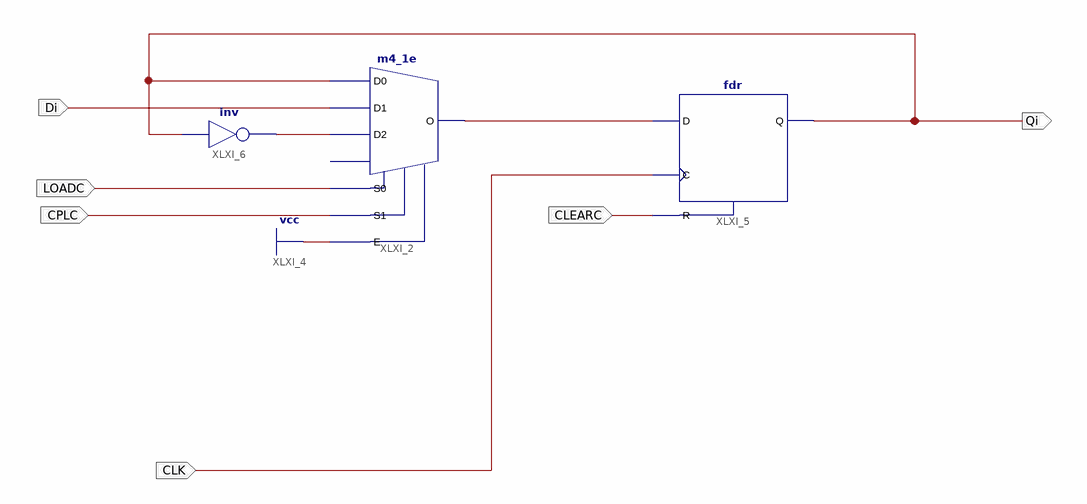
[diagram p0: schematic sheet 1]
// Xilinx ISE schematic C.sch (spartan3e) as structural Verilog: 3 symbols, 6 ports
module C (
  input  CLK,
  input  CPLC,
  input  LOADC,
  input  Di,
  input  CLEARC,
  output Qi
);

  wire XLXN_1, XLXN_9;

  m4_1e XLXI_2 (.D0(Qi), .D1(Di), .D2(XLXN_9), .E(1'b1), .S0(LOADC), .S1(CPLC), .O(XLXN_1));  // open: D3
  fdr XLXI_5 (.C(CLK), .D(XLXN_1), .R(CLEARC), .Q(Qi));
  not XLXI_6 (XLXN_9, Qi);
endmodule
